# Altium schematic sheet ProbadorDeCables_Conexiones_B.SchDoc
size A4
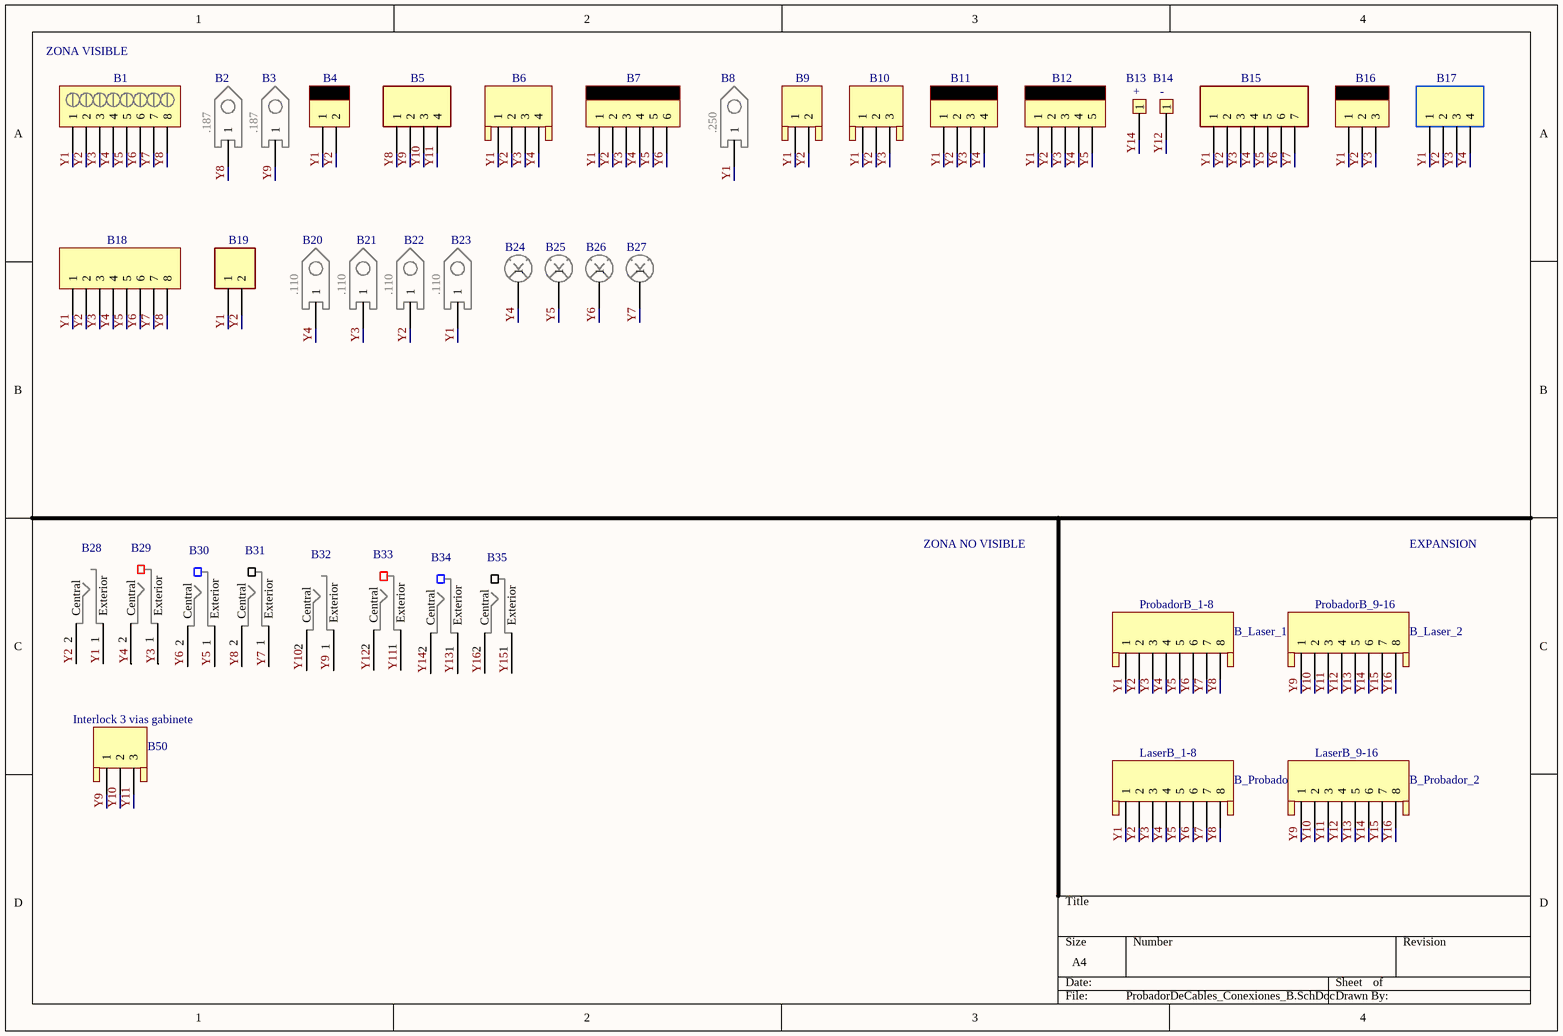
[diagram p0: ProbadorDeCables_Conexiones_B.SchDoc]

## Parts
B1  Bornera con tornillos 8 vías  [Bornera con tornillos 8 vías]  (value not drawn)
B2  Pala macho 4.8 para placa  [Pala macho 4.8 para placa]  (value not drawn)
B3  Pala macho 4.8 para placa  [Pala macho 4.8 para placa]  (value not drawn)
B4  Para_SL-156__640445-2  [640445-2]  (value not drawn)
B5  JST_2.5_4  [B4B-XH-A]  (value not drawn)
B6  Para_CST_100__640456-4  [640456-4]  (value not drawn)
B7  Para_SL-156__640445-6  [640445-6]  (value not drawn)
B8  Pala macho 6.3 para placa  [Pala macho 6.3 para placa]  (value not drawn)
B9  Para_CST_100__640456-2  [640456-2]  (value not drawn)
B10  Para_CST_100__640456-3  [640456-3]  (value not drawn)
B11  Para_SL-156__640445-4  [640445-4]  (value not drawn)
B12  Para_SL-156__640445-5  [640445-5]  (value not drawn)
B13  +  [Pin macho para crio]
B14  -  [Pin macho para crio]
B15  JST_2.5_7  [B7B-XH-A]  (value not drawn)
B16  Para_SL-156__640445-3  [640445-3]  (value not drawn)
B17  USB 2_0 A  [USB2.0_A]  (value not drawn)
B18  Fuente MSP-300-15  [DF11-8DP-2DSA(01)]  (value not drawn)
B19  JST_2.5_2  [B2B-XH-A]  (value not drawn)
B20  Pala macho 2.7 para placa  [Pala macho 2.7 para placa]  (value not drawn)
B21  Pala macho 2.7 para placa  [Pala macho 2.7 para placa]  (value not drawn)
B22  Pala macho 2.7 para placa  [Pala macho 2.7 para placa]  (value not drawn)
B23  Pala macho 2.7 para placa  [Pala macho 2.7 para placa]  (value not drawn)
B24  Tornillo M4 para placa  [SCREW M4 4 PIN PCB]  (value not drawn)
B25  Tornillo M4 para placa  [SCREW M4 4 PIN PCB]  (value not drawn)
B26  Tornillo M4 para placa  [SCREW M4 4 PIN PCB]  (value not drawn)
B27  Tornillo M4 para placa  [SCREW M4 4 PIN PCB]  (value not drawn)
B28  RCA mono para placa - Blanco  [RCJ-023]  (value not drawn)
B29  RCA mono para placa - Rojo  [RCJ-022]  (value not drawn)
B30  RCA mono para placa - Azul  [RCJ-025]  (value not drawn)
B31  RCA mono para placa - Negro  [RCJ-021]  (value not drawn)
B32  RCA mono para placa - Blanco  [RCJ-023]  (value not drawn)
B33  RCA mono para placa - Rojo  [RCJ-022]  (value not drawn)
B34  RCA mono para placa - Azul  [RCJ-025]  (value not drawn)
B35  RCA mono para placa - Negro  [RCJ-021]  (value not drawn)
B50  Interlock 3 vias gabinete  [640456-3]
B_Laser_1  ProbadorB_1-8  [640456-8]
B_Laser_2  ProbadorB_9-16  [640456-8]
B_Probador_1  LaserB_1-8  [640456-8]
B_Probador_2  LaserB_9-16  [640456-8]

## Nets
Y1: B1.1 B4.1 B6.1 B7.1 B8.1 B9.1 B10.1 B11.1 B12.1 B15.1 B16.1 B17.1 B18.1 B19.1 B23.1 B28.1(Exterior) B_Laser_1.1 B_Probador_1.1
Y2: B1.2 B4.2 B6.2 B7.2 B9.2 B10.2 B11.2 B12.2 B15.2 B16.2 B17.2 B18.2 B19.2 B22.1 B28.2(Central) B_Laser_1.2 B_Probador_1.2
Y3: B1.3 B6.3 B7.3 B10.3 B11.3 B12.3 B15.3 B16.3 B17.3 B18.3 B21.1 B29.1(Exterior) B_Laser_1.3 B_Probador_1.3
Y4: B1.4 B6.4 B7.4 B11.4 B12.4 B15.4 B17.4 B18.4 B20.1 B24.1 B29.2(Central) B_Laser_1.4 B_Probador_1.4
Y5: B1.5 B7.5 B12.5 B15.5 B18.5 B25.1 B30.1(Exterior) B_Laser_1.5 B_Probador_1.5
Y6: B1.6 B7.6 B15.6 B18.6 B26.1 B30.2(Central) B_Laser_1.6 B_Probador_1.6
Y7: B1.7 B15.7 B18.7 B27.1 B31.1(Exterior) B_Laser_1.7 B_Probador_1.7
Y8: B1.8 B2.1 B5.1 B18.8 B31.2(Central) B_Laser_1.8 B_Probador_1.8
Y9: B3.1 B5.2 B32.1(Exterior) B50.1 B_Laser_2.1 B_Probador_2.1
Y10: B5.3 B32.2(Central) B50.2 B_Laser_2.2 B_Probador_2.2
Y11: B5.4 B33.1(Exterior) B50.3 B_Laser_2.3 B_Probador_2.3
Y12: B14.1 B33.2(Central) B_Laser_2.4 B_Probador_2.4
Y13: B34.1(Exterior) B_Laser_2.5 B_Probador_2.5
Y14: B13.1 B34.2(Central) B_Laser_2.6 B_Probador_2.6
Y15: B35.1(Exterior) B_Laser_2.7 B_Probador_2.7
Y16: B35.2(Central) B_Laser_2.8 B_Probador_2.8

## Notes on the sheet
- ZONA VISIBLE
- ZONA NO VISIBLE
- EXPANSION
- (in symbol Pala macho 2.7 para placa) .110
- (in symbol Pala macho 4.8 para placa) .187
- (in symbol Pala macho 6.3 para placa) .250

## Library data of the parts
B1 = Bornera con tornillos 8 vías: TERMINAL BLOCK SCREW TYPE 5.08; Cod.Fabricante: TB008A-508-08BE; Fabricante: CUI Devices; Cod.Digikey: 102-6216-ND; DIGIKEYx100: 1.03600; ComponentLink2URL: https://www.cuidevices.com/product/resource/digikeypdf/tb008a-508.pdf; ComponentLink2Description: Datasheet
B2 B3 = Pala macho 4.8 para placa: CONN QC TAB 0.187 SOLDER; Cod.Fabricante: 1217124-1; Fabricante: TE Connectivity AMP Connectors; Cod.DigiKey: A110908CT-ND; ComponentLink1Description: Manufacturer Link; ComponentLink1URL: https://www.te.com/commerce/DocumentDelivery/DDEController?Action=srchrtrv&DocNm=1217124&DocType=Customer+Drawing&DocLang=English; DIGIKEYx100: 0.13260
B4 = Para_SL-156__640445-2: CONN HEADER VERT 2POS .156 TIN; Fabricante: TE Connectivity AMP Connectors; Cod.Digikey: A1971-ND; Cod.Fabricante: 640445-2; DIGIKEYx100: 0.07960; ComponentLink2URL: https://www.te.com/commerce/DocumentDelivery/DDEController?Action=srchrtrv&DocNm=640445&DocType=Customer+Drawing&DocLang=English; ComponentLink2Description: Datasheet
B5 = JST_2.5_4: CONN HEADER XH TOP 4POS 2.5MM; Cod.Fabricante: B4B-XH-A(LF)(SN); Fabricante: JST Sales America Inc.; LatestRevisionDate: 17-Jul-2002; LatestRevisionNote: Re-released for DXP Platform.; Publisher: Altium Limited; Cod.Digikey: 455-2249-ND; ComponentLink2Description: Datasheet; ComponentLink2URL: http://www.jst-mfg.com/product/pdf/eng/eXH.pdf; DIGIKEYx100: 0.13480
B6 = Para_CST_100__640456-4: CONN HEADER VERT 4POS .100 TIN; Cod.Fabricante: 640456-2; Fabricante: TE Connectivity AMP Connectors; LatestRevisionDate: 17-Jul-2002; LatestRevisionNote: Re-released for DXP Platform.; Publisher: Altium Limited; Cod.Digikey: A1922-ND; DIGIKEYx100: 0.14850; ComponentLink2URL: http://www.te.com/commerce/DocumentDelivery/DDEController?Action=srchrtrv&DocNm=640456&DocType=Customer+Drawing&DocLang=English; ComponentLink2Description: Datasheet
B7 = Para_SL-156__640445-6: CONN HEADER VERT 6POS .156 TIN; Fabricante: TE Connectivity AMP Connectors; Cod.Digikey: A1973-ND; Cod.Fabricante: 640445-6; DIGIKEYx100: 0.28780; ComponentLink2URL: https://www.te.com/commerce/DocumentDelivery/DDEController?Action=srchrtrv&DocNm=640445&DocType=Customer+Drawing&DocLang=English; ComponentLink2Description: Datasheet
B8 = Pala macho 6.3 para placa: CONN QC TAB 0.250 SOLDER; Cod.Fabricante: 1217125-1; Fabricante: TE Connectivity AMP Connectors; Cod.DigiKey: A110909CT-ND; ComponentLink1Description: Manufacturer Link; ComponentLink1URL: https://www.te.com/commerce/DocumentDelivery/DDEController?Action=srchrtrv&DocNm=1217125&DocType=Customer+Drawing&DocLang=English; DIGIKEYx100: 0.17180
B9 = Para_CST_100__640456-2: CONN HEADER VERT 2POS .100 TIN; Fabricante: TE Connectivity AMP Connectors; LatestRevisionDate: 17-Jul-2002; LatestRevisionNote: Re-released for DXP Platform.; Publisher: Altium Limited; Cod.Digikey: A1921-ND; Cod.Fabricante: 640456-2; DIGIKEYx100: 0.06630; ComponentLink2URL: http://www.te.com/commerce/DocumentDelivery/DDEController?Action=srchrtrv&DocNm=640456&DocType=Customer+Drawing&DocLang=English; ComponentLink2Description: Datasheet
B10 B50 = Para_CST_100__640456-3: CONN HEADER VERT 3POS .100 TIN; Fabricante: TE Connectivity AMP Connectors; LatestRevisionDate: 17-Jul-2002; LatestRevisionNote: Re-released for DXP Platform.; Publisher: Altium Limited; Cod.Digikey: A19470-ND; Cod.Fabricante: 640456-3; DIGIKEYx100: 0.08910; ComponentLink2URL: http://www.te.com/commerce/DocumentDelivery/DDEController?Action=srchrtrv&DocNm=640456&DocType=Customer+Drawing&DocLang=English; ComponentLink2Description: Datasheet
B11 = Para_SL-156__640445-4: CONN HEADER VERT 4POS .156 TIN; Fabricante: TE Connectivity AMP Connectors; Cod.Digikey: A1972-ND; Cod.Fabricante: 640445-4; DIGIKEYx100: 0.18210; ComponentLink2URL: https://www.te.com/commerce/DocumentDelivery/DDEController?Action=srchrtrv&DocNm=640445&DocType=Customer+Drawing&DocLang=English; ComponentLink2Description: Datasheet
B12 = Para_SL-156__640445-5: CONN HEADER VERT 5POS .156 TIN; Fabricante: TE Connectivity AMP Connectors; Cod.Digikey: A19891-ND; Cod.Fabricante: 640445-5; DIGIKEYx100: 0.23490; ComponentLink2URL: https://www.te.com/commerce/DocumentDelivery/DDEController?Action=srchrtrv&DocNm=640445&DocType=Customer+Drawing&DocLang=English; ComponentLink2Description: Datasheet
B13 B14 = Pin macho para crio: CONN PC PIN CIRC 0.058DIA TIN; Cod.Fabricante: 3-60599-1; Fabricante: TE Connectivity AMP Connectors; Cod.DigiKey: 3-60599-1-ND; ComponentLink1Description: Manufacturer Link; ComponentLink1URL: http://www.keyelco.com/product-pdf.cfm?p=1054; DIGIKEYx50: 0.74940; DIGIKEYx100: 0.71680
B15 = JST_2.5_7: CONN HEADER XH TOP 7POS 2.5MM; Cod.Fabricante: B7B-XH-A(LF)(SN); Fabricante: JST Sales America Inc.; LatestRevisionDate: 17-Jul-2002; LatestRevisionNote: Re-released for DXP Platform.; Publisher: Altium Limited; Cod.Digikey: 455-2252-ND; ComponentLink2Description: Datasheet; ComponentLink2URL: http://www.jst-mfg.com/product/pdf/eng/eXH.pdf; DIGIKEYx100: 0.2156
B16 = Para_SL-156__640445-3: CONN HEADER VERT 3POS .156 TIN; Fabricante: TE Connectivity AMP Connectors; Cod.Digikey: A19890-ND; Cod.Fabricante: 640445-3; DIGIKEYx100: 0.13710; ComponentLink2URL: https://www.te.com/commerce/DocumentDelivery/DDEController?Action=srchrtrv&DocNm=640445&DocType=Customer+Drawing&DocLang=English; ComponentLink2Description: Datasheet
B17 = USB 2_0 A: CONN RCPT USB2.0 TYPEA 4POS VERT; Cod.Fabricante: 1050570001; Fabricante: Molex; Cod.Digikey: WM8672-ND; ComponentLink2Description: Datasheet; ComponentLink2URL: https://www.molex.com/pdm_docs/sd/1050570001_sd.pdf; DIGIKEYx100: 0.69030
B18 = DF11-8DP-2DSA(01): CONN HEADER VERT 8POS 2MM; Fabricante: Hirose Electric Co Ltd; LatestRevisionDate: 17-Jul-2002; LatestRevisionNote: Re-released for DXP Platform.; Publisher: Altium Limited; Cod.Digikey: H2852-ND; Cod.Fabricante: DF11-8DP-2DSA(01); DIGIKEYx100: 0.72600; ComponentLink2URL: https://www.hirose.com/product/download/?distributor=digikey&type=specSheet&lang=en&num=DF11-8DP-2DSA(01); ComponentLink2Description: Datasheet
B19 = JST_2.5_2: CONN HEADER XH TOP 2POS 2.5MM; Cod.Fabricante: B2B-XH-A(LF)(SN); Fabricante: JST Sales America Inc.; LatestRevisionDate: 17-Jul-2002; LatestRevisionNote: Re-released for DXP Platform.; Publisher: Altium Limited; Cod.Digikey: 455-2247-ND; DIGIKEYx50: 0.08980; ComponentLink2URL: http://www.jst-mfg.com/product/pdf/eng/eXH.pdf; ComponentLink2Description: Datasheet
B20-B23 = Pala macho 2.7 para placa: CONN QC TAB 0.110 SOLDER; Cod.Fabricante: 735187-2; Fabricante: TE Connectivity AMP Connectors; Cod.DigiKey: A107001-ND; ComponentLink1Description: Manufacturer Link; ComponentLink1URL: https://www.te.com/commerce/DocumentDelivery/DDEController?Action=srchrtrv&DocNm=735187&DocType=Customer+Drawing&DocLang=English; DIGIKEYx100: 0.11110
B24-B27 = Tornillo M4 para placa: TERM SCREW M4 4 PIN PCB; Cod.Fabricante: 7795; Fabricante: Keystone Electronics; Cod.Digikey: 36-7795-ND; DIGIKEYx100: 0.38960; ComponentLink2URL: http://keyelco.com/userAssets/file/M65p69.pdf; ComponentLink2Description: Datasheet
B28 B32 = RCA mono para placa - Blanco: CONN RCA JACK MONO 3.2MM PCB; Fabricante: CUI Devices; Cod.Digikey: CP-1408-ND; Cod.Fabricante: RCJ-023; DIGIKEYx100: 0.66880; ComponentLink2URL: https://www.cuidevices.com/product/resource/digikeypdf/rcj-02x.pdf; ComponentLink2Description: Datasheet
B29 B33 = RCA mono para placa - Rojo: CONN RCA JACK MONO 3.2MM PCB; Fabricante: CUI Devices; Cod.Digikey: CP-1407-ND; Cod.Fabricante: RCJ-022; DIGIKEYx100: 0.66880; ComponentLink2URL: https://www.cuidevices.com/product/resource/digikeypdf/rcj-02x.pdf; ComponentLink2Description: Datasheet
B30 B34 = RCA mono para placa - Azul: CONN RCA JACK MONO 3.2MM PCB; Fabricante: CUI Devices; Cod.Digikey: CP-1410-ND; Cod.Fabricante: RCJ-025; DIGIKEYx100: 0.66880; ComponentLink2URL: https://www.cuidevices.com/product/resource/digikeypdf/rcj-02x.pdf; ComponentLink2Description: Datasheet
B31 B35 = RCA mono para placa - Negro: CONN RCA JACK MONO 3.2MM PCB; Fabricante: CUI Devices; Cod.Digikey: CP-1406-ND; Cod.Fabricante: RCJ-021; DIGIKEYx100: 0.66880; ComponentLink2URL: https://www.cuidevices.com/product/resource/digikeypdf/rcj-02x.pdf; ComponentLink2Description: Datasheet
B_Laser_1 B_Laser_2 B_Probador_1 B_Probador_2 = Para_CST_100__640456-8: CONN HEADER VERT 8POS .100 TIN; Fabricante: TE Connectivity AMP Connectors; Cod.Digikey: A1924-ND; Cod.Fabricante: 640456-8; DIGIKEYx100: 0.29070; ComponentLink2URL: http://www.te.com/commerce/DocumentDelivery/DDEController?Action=srchrtrv&DocNm=640456&DocType=Customer+Drawing&DocLang=English; ComponentLink2Description: Datasheet